# EAGLE design plotter (EAGLE 8.2.1)
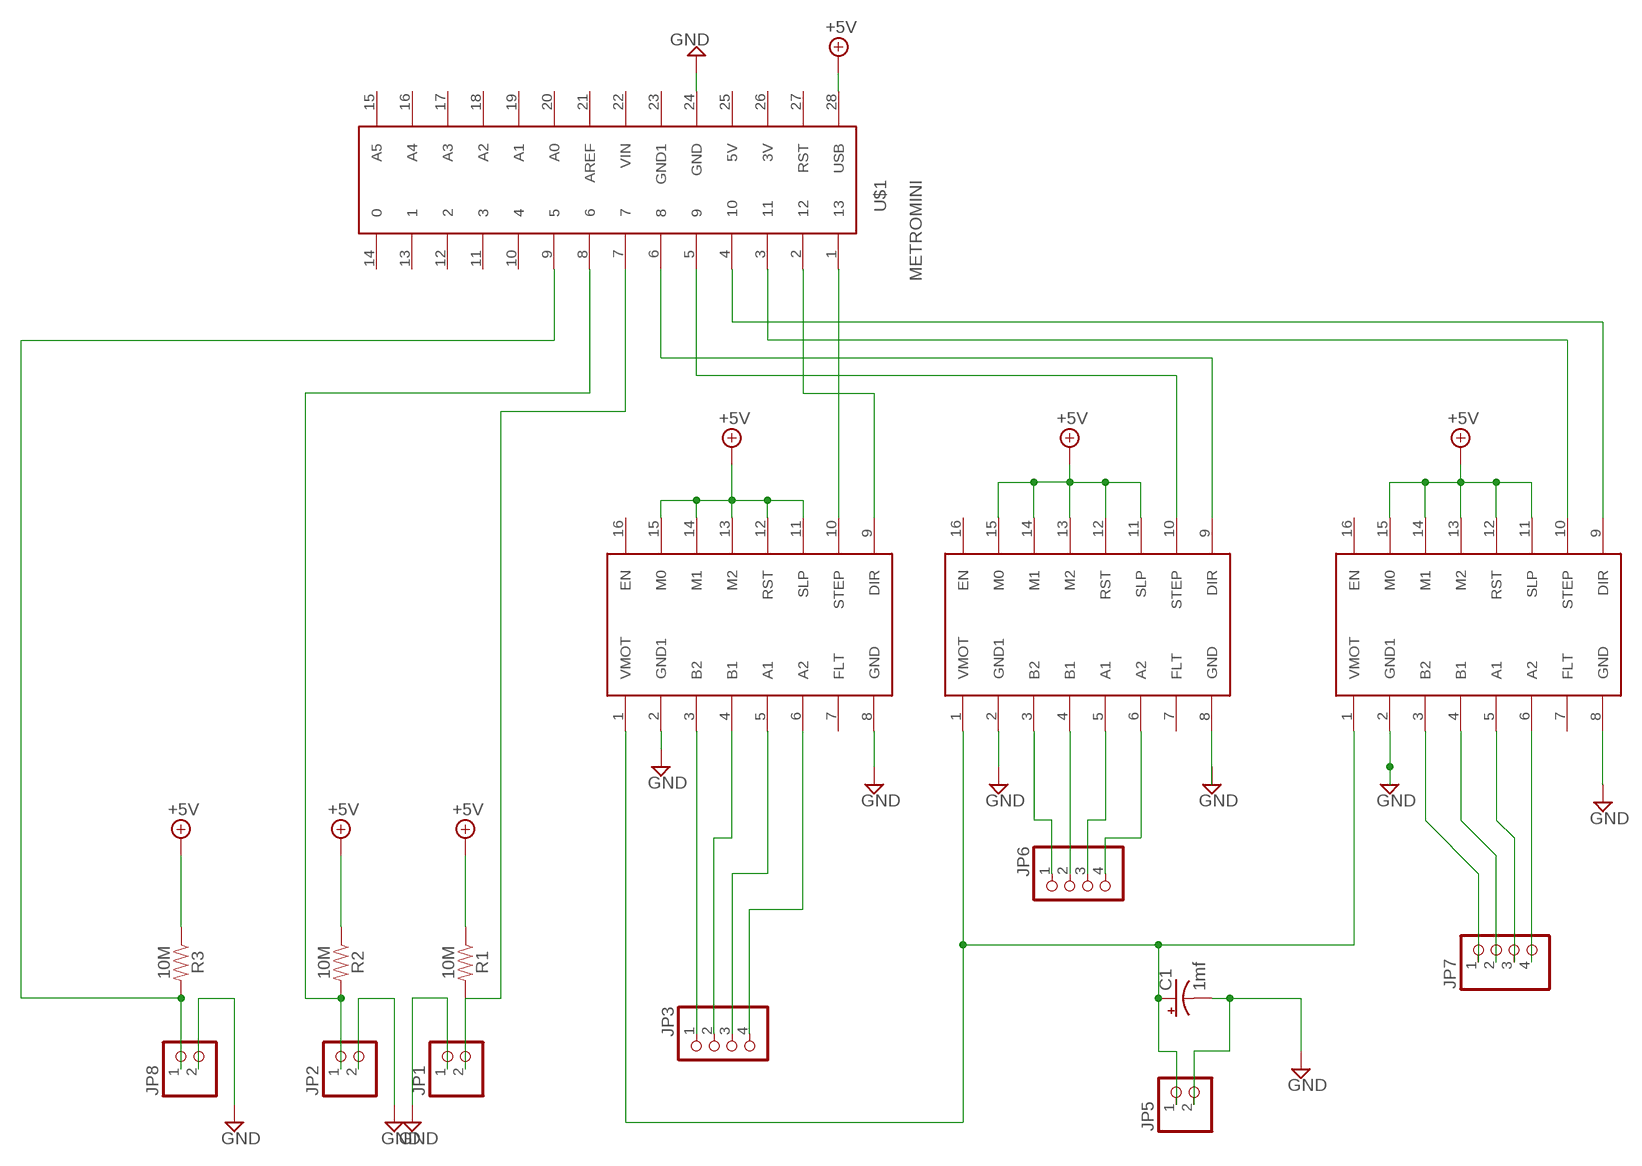
[diagram p0: schematic, sheet 1]

## Parts
C1  1mf  1000UF-RADIAL-5MM-35V-20%-KIT  [CPOL-RADIAL-5MM-10MM-KIT]
JP1  PINHD-1X2  [1X02]
JP2  PINHD-1X2  [1X02]
JP3  PINHD-1X4  [1X04]
JP5  PINHD-1X2  [1X02]
JP6  PINHD-1X4  [1X04]
JP7  PINHD-1X4  [1X04]
JP8  PINHD-1X2  [1X02]
R1  10M  10MOHM-HORIZ-1/4W-5%  [AXIAL-0.3]
R2  10M  10MOHM-HORIZ-1/4W-5%  [AXIAL-0.3]
R3  10M  10MOHM-HORIZ-1/4W-5%  [AXIAL-0.3]
U$1  METROMINI  [METROMINI]
U$2  DRV8825  [DRV8825]
U$3  DRV8825  [DRV8825]
U$4  DRV8825  [DRV8825]

## Nets
+5V [power]: R1.P$1 R2.P$1 R3.P$1 U$1.28(USB) U$2.11(SLP) U$2.12(RST) U$2.13(M2) U$2.14(M1) U$2.15(M0) U$3.11(SLP) U$3.12(RST) U$3.13(M2) U$3.14(M1) U$3.15(M0) U$4.11(SLP) U$4.12(RST) U$4.13(M2) U$4.14(M1) U$4.15(M0)
GND [gnd]: C1.- JP1.1 JP2.2 JP5.2 JP8.2 U$1.24(GND) U$2.2(GND1) U$2.8(GND) U$3.2(GND1) U$3.8(GND) U$4.2(GND1) U$4.8(GND)
N$1: JP1.2 R1.P$2 U$1.7
N$4: JP8.1 R3.P$2 U$1.9
N$12: JP2.1 R2.P$2 U$1.8
N$20: JP6.1 U$2.3(B2)
N$21: JP6.2 U$2.4(B1)
N$23: JP6.4 U$2.6(A2)
N$24: JP7.1 U$3.3(B2)
N$25: JP7.2 U$3.4(B1)
N$26: JP7.3 U$3.5(A1)
N$27: JP7.4 U$3.6(A2)
N$28: U$1.4 U$3.9(DIR)
N$29: U$1.6 U$2.9(DIR)
N$30: U$1.5 U$2.10(STEP)
N$31: U$1.3 U$3.10(STEP)
N$39: JP3.2 U$4.4(B1)
N$41: U$1.2 U$4.9(DIR)
N$42: U$1.1 U$4.10(STEP)
N$44: JP6.3 U$2.5(A1)
N$45: JP3.1 U$4.3(B2)
N$46: JP3.3 U$4.5(A1)
N$48: JP3.4 U$4.6(A2)
N$53: C1.+ JP5.1 U$2.1(VMOT) U$3.1(VMOT) U$4.1(VMOT)
Unconnected: U$1.10 U$1.11 U$1.12 U$1.13 U$1.14 U$1.15(A5) U$1.16(A4) U$1.17(A3) U$1.18(A2) U$1.19(A1) U$1.20(A0) U$1.21(AREF) U$1.22(VIN) U$1.23(GND1) U$1.25(5V) U$1.26(3V) U$1.27(RST) U$2.7(FLT) U$2.16(EN) U$3.7(FLT) U$3.16(EN) U$4.7(FLT) U$4.16(EN)

## Library data of the parts
C1 = SparkFun-Capacitors:1000UF: 1,000µF/1mF ceramic capacitors A capacitor is a passive two-terminal electrical component used to store electrical energy temporarily in an electric field. CAP-08070; PROD_ID: CAP-09538
JP1 JP2 JP5 JP8 = pinhead:PINHD-1X2: PIN HEADER
JP3 JP6 JP7 = pinhead:PINHD-1X4: PIN HEADER
R1-R3 = SparkFun-Resistors:10MOHM: RES-09327; PROD_ID: RES-09327
U$1 = julian:METROMINI
U$2-U$4 = julian:DRV8825

## Net classes
0 default: width 0.457 mm, drill 0.457 mm, clearance 0.457 mm
1 power: width 0.457 mm, drill 0.457 mm, clearance 0.457 mm
2 gnd: width 0.457 mm, drill 0.457 mm, clearance 0.457 mm
3 usbvcc: width 0.457 mm, drill 0.457 mm, clearance 0.457 mm
4 aref: width 0.254 mm, drill 0.457 mm, clearance 0.457 mm

## Board
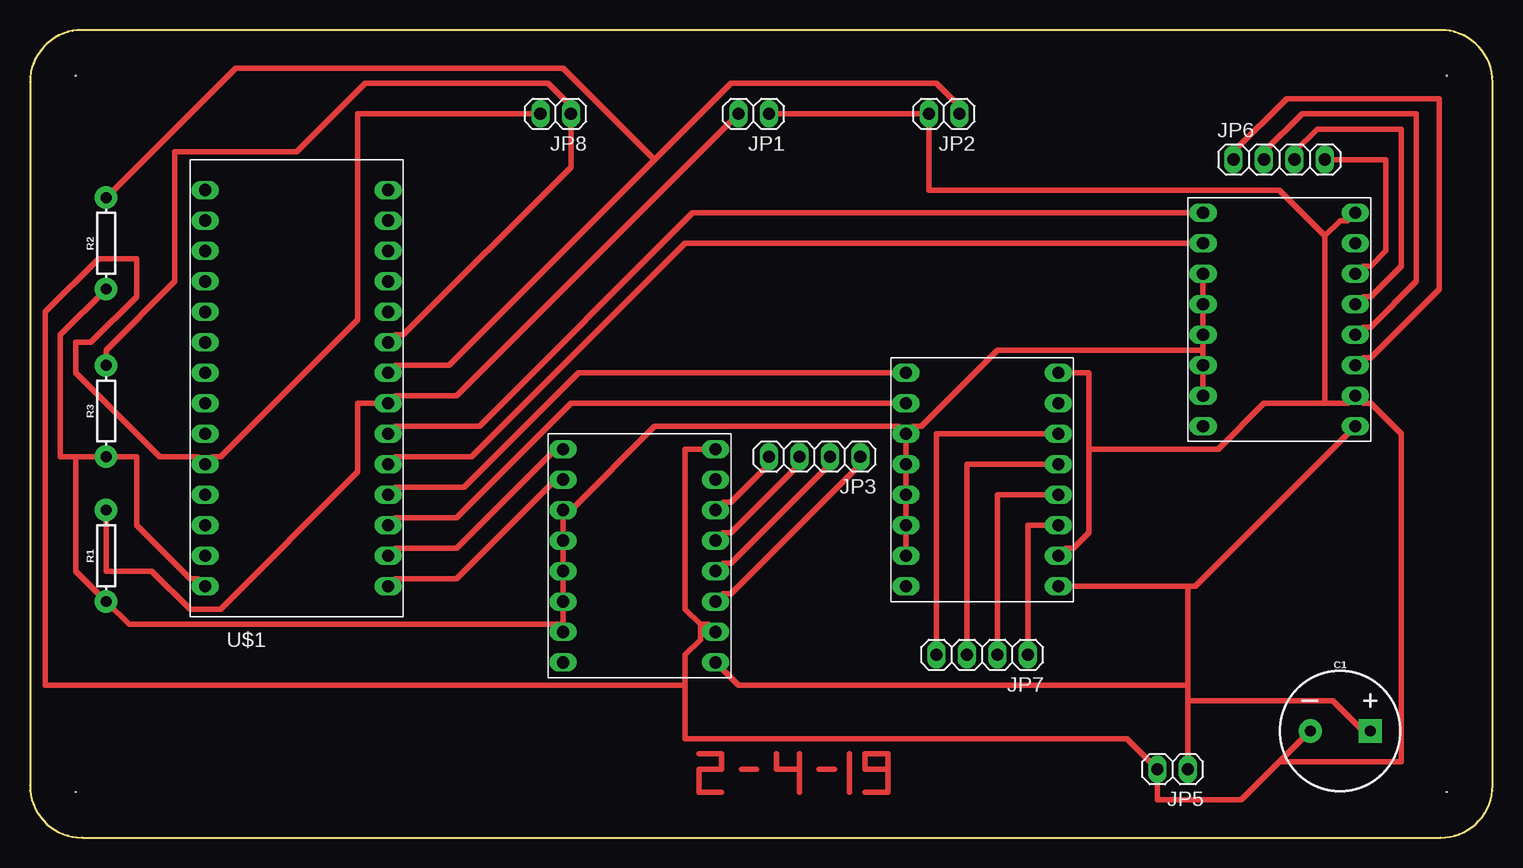
[diagram p1: board, top side]

Size 121.92 x 67.31 mm. Coordinates in mm from the lower left corner, seen from the top.
Outline: 117.58,67.31 4.34,67.31 arc90 0,62.97 0,4.34 arc90 4.34,0 117.58,0 arc90 121.92,4.34 121.92,62.97 arc90 117.58,67.31
Copper layers (1*16): Top 0.035mm / dielectric 1.5mm / Bottom 0.035mm
Design rules "OthermillDRC_1_32_v2": minimum track width 8mil, minimum drill 0.8mm, track to track 0.794003125mm, track to pad 0.794003125mm, pad to pad 0.794003125mm, via to via 0.794003125mm, smd to smd 0mil, copper to edge 0mil, drill to drill 1mil, minimum pad ring 10mil, minimum via ring 10mil, stop-mask expansion 1mil, vias tented up to drill 30mil, thermal gap 10mil
Holes 0.06 mm at 3.81,3.81 118.11,3.81 118.11,63.5 3.81,63.5

### Footprints (pad centres in the part's own frame; a part is rotated, then mirrored left to right if it is on the bottom)
CPOL-RADIAL-5MM-10MM-KIT = drill 0.9 pad 1.93 square: + 2.5,0 | drill 0.9 pad 1.93: - -2.5,0
1X02 = drill 1.016 long: 1 -1.27,0; 2 1.27,0
1X04 = drill 1.016 long: 1 -3.81,0; 2 -1.27,0; 3 1.27,0; 4 3.81,0
AXIAL-0.3 = drill 0.9 pad 1.88: P$1 -3.81,0; P$2 3.81,0
METROMINI = drill 1.016 long: 1 -16.51,-3.81; 2 -13.97,-3.81; 3 -11.43,-3.81; 4 -8.89,-3.81; 5 -6.35,-3.81; 6 -3.81,-3.81; 7 -1.27,-3.81; 8 1.27,-3.81; 9 3.81,-3.81; 10 6.35,-3.81; 11 8.89,-3.81; 12 11.43,-3.81; 13 13.97,-3.81; 14 16.51,-3.81; 15 16.51,11.43; 16 13.97,11.43; 17 11.43,11.43; 18 8.89,11.43; 19 6.35,11.43; 20 3.81,11.43; 21 1.27,11.43; 22 -1.27,11.43; 23 -3.81,11.43; 24 -6.35,11.43; 25 -8.89,11.43; 26 -11.43,11.43; 27 -13.97,11.43; 28 -16.51,11.43
DRV8825 = drill 1.016 long: 1 -7.62,-1.27; 2 -5.08,-1.27; 3 -2.54,-1.27; 4 0,-1.27; 5 2.54,-1.27; 6 5.08,-1.27; 7 7.62,-1.27; 8 10.16,-1.27; 9 10.16,11.43; 10 7.62,11.43; 11 5.08,11.43; 12 2.54,11.43; 13 0,11.43; 14 -2.54,11.43; 15 -5.08,11.43; 16 -7.62,11.43

### Placement (x,y rotation side)
C1  109.22,8.89 0 top
JP1  60.33,60.33 180 top
JP2  76.2,60.33 180 top
JP3  65.41,31.75 180 top
JP5  95.25,5.71 180 top
JP6  104.14,56.52 0 top
JP7  79.38,15.24 180 top
JP8  43.82,60.33 180 top
R1  6.35,23.5 90 top
R2  6.35,49.53 90 top
R3  6.35,35.56 90 top
U$1  26.04,37.47 90 top
U$2  109.22,41.91 90 top
U$3  84.45,28.57 90 top
U$4  55.88,22.23 90 top

### Tracks (layer width: path | path; a pad name or v marks a point on that pad's centre or on a via)
+5V
  Top 0.457: U$3.15 U$3.14 U$3.13 U$3.12 U$3.11 | U$2.15 U$2.14 97.79,40.64 | U$2.11 U$2.12 U$2.13 97.79,40.64 | U$3.11 73.66,34.29 74.3,34.29 80.64,40.64 97.79,40.64 | 44.45,17.78 U$4.14 U$4.13 U$4.12 U$4.11 45.09,27.3 52.07,34.29 72.39,34.29 U$3.11 | U$1.28 13.97,21.59 13.33,21.59 8.89,26.04 8.89,31.75 R3.P$1 3.81,31.75 | 3.81,31.75 3.81,22.23 R1.P$1 8.26,17.78 44.45,17.78 | R2.P$1 2.54,41.91 2.54,31.75 3.81,31.75 | 44.45,17.78 U$4.15
GND
  Top 0.457: JP1.1 JP2.2 74.93,53.98 104.14,53.98 107.95,50.16 | U$3.2 86.36,24.13 86.99,24.13 88.27,25.4 88.27,32.38 | 88.27,32.38 88.27,38.73 U$3.8 | 107.95,36.2 102.87,36.2 99.06,32.38 88.27,32.38 | 107.95,36.2 109.85,36.2 U$2.2 111.12,36.2 111.76,36.2 114.3,33.66 114.3,6.35 104.14,6.35 | U$2.8 109.85,51.44 109.22,51.44 107.95,50.16 | 107.95,36.2 107.95,50.16 | JP8.2 27.3,60.33 27.3,43.18 15.88,31.75 15.24,31.75 U$1.24 13.97,31.75 10.79,31.75 3.81,38.73 3.81,41.27 5.08,41.27 8.89,45.09 8.89,48.26 5.71,48.26 1.27,43.81 1.27,12.7 54.61,12.7 | U$4.2 56.52,17.78 55.88,17.78 | 55.88,17.78 54.61,19.05 54.61,32.38 U$4.8 | 104.14,6.35 106.68,8.89 C1.- | 104.14,6.35 100.96,3.17 93.98,3.17 JP5.2 91.44,8.26 54.61,8.26 54.61,12.7 | 55.88,17.78 55.88,16.51 54.61,15.24 54.61,12.7
N$1
  Top 0.457: JP1.2 35.56,36.83 30.48,36.83 U$1.7 27.3,36.2 27.3,30.48 15.88,19.05 13.33,19.05 10.16,22.23 6.35,22.23 R1.P$2
N$3
  Top 0.457: 64.14,5.71 62.23,5.71 62.23,6.99 | 64.14,5.71 64.14,6.99 | 64.14,5.71 64.14,3.81
N$4
  Top 0.457: U$1.9 30.48,41.91 31.11,41.91 45.09,55.88 JP8.1 45.09,60.96 43.18,62.87 27.94,62.87 22.22,57.15 12.06,57.15 12.06,46.35 6.35,40.64 R3.P$2
N$10
  Top 0.457: 59.31,5.71 60.58,5.71
N$12
  Top 0.457: U$1.8 30.48,39.37 34.93,39.37 52.07,56.52 | 52.07,56.52 58.42,62.87 75.56,62.87 77.47,60.96 JP2.1 | R2.P$2 17.14,64.14 44.45,64.14 52.07,56.52
N$20
  Top 0.457: U$2.3 111.12,40.01 111.76,40.01 117.47,45.72 117.47,61.59 104.77,61.59 100.33,57.15 JP6.1
N$21
  Top 0.457: U$2.4 111.12,42.55 111.76,42.55 115.57,46.35 115.57,60.33 106.05,60.33 102.87,57.15 JP6.2
N$22
  Top 0.457: 55.75,6.99 57.66,6.99 57.66,5.71 55.75,5.71 55.75,3.81 57.66,3.81
N$23
  Top 0.457: U$2.6 111.12,47.62 111.76,47.62 113.03,48.9 113.03,56.52 JP6.4
N$24
  Top 0.457: JP7.1 83.19,26.04 U$3.3
N$25
  Top 0.457: JP7.2 80.64,28.57 U$3.4
N$26
  Top 0.457: JP7.3 78.1,31.11 U$3.5
N$27
  Top 0.457: JP7.4 75.56,33.66 U$3.6
N$28
  Top 0.457: U$1.4 30.48,29.21 36.2,29.21 45.72,38.73 U$3.9
N$29
  Top 0.457: U$1.6 30.48,34.29 37.47,34.29 55.25,52.07 U$2.9
N$30
  Top 0.457: U$1.5 30.48,31.75 36.83,31.75 54.61,49.53 U$2.10
N$31
  Top 0.457: U$1.3 30.48,26.67 35.56,26.67 45.09,36.2 U$3.10
N$36
  Top 0.457: 65.79,5.71 67.06,5.71
N$37
  Top 0.457: 68.33,6.99 68.33,3.81
N$38
  Top 0.457: 69.6,3.81 71.5,3.81 71.5,5.71 | 71.5,5.71 71.5,6.99 69.6,6.99 69.6,5.71 71.5,5.71
N$39
  Top 0.457: U$4.4 57.79,22.86 58.42,22.86 66.67,31.11 JP3.2
N$41
  Top 0.457: U$1.2 30.48,24.13 35.56,24.13 43.82,32.38 U$4.9
N$42
  Top 0.457: U$1.1 30.48,21.59 35.56,21.59 43.82,29.84 U$4.10
N$44
  Top 0.457: U$2.5 111.12,45.09 111.76,45.09 114.3,47.62 114.3,59.05 107.31,59.05 105.41,57.15 JP6.3
N$45
  Top 0.457: U$4.3 57.79,20.32 58.42,20.32 69.21,31.11 JP3.1
N$46
  Top 0.457: U$4.5 57.79,25.4 58.42,25.4 64.14,31.11 JP3.3
N$48
  Top 0.457: U$4.6 57.79,27.94 58.42,27.94 61.6,31.11 JP3.4
N$53
  Top 0.457: 96.52,20.95 96.52,12.7 | 96.52,12.7 96.52,11.43 | 96.52,11.43 JP5.1 | U$3.1 96.52,20.95 | U$4.1 59.05,12.7 96.52,12.7 | U$2.1 97.16,20.95 96.52,20.95 | 96.52,11.43 108.58,11.43 111.12,8.89 C1.+